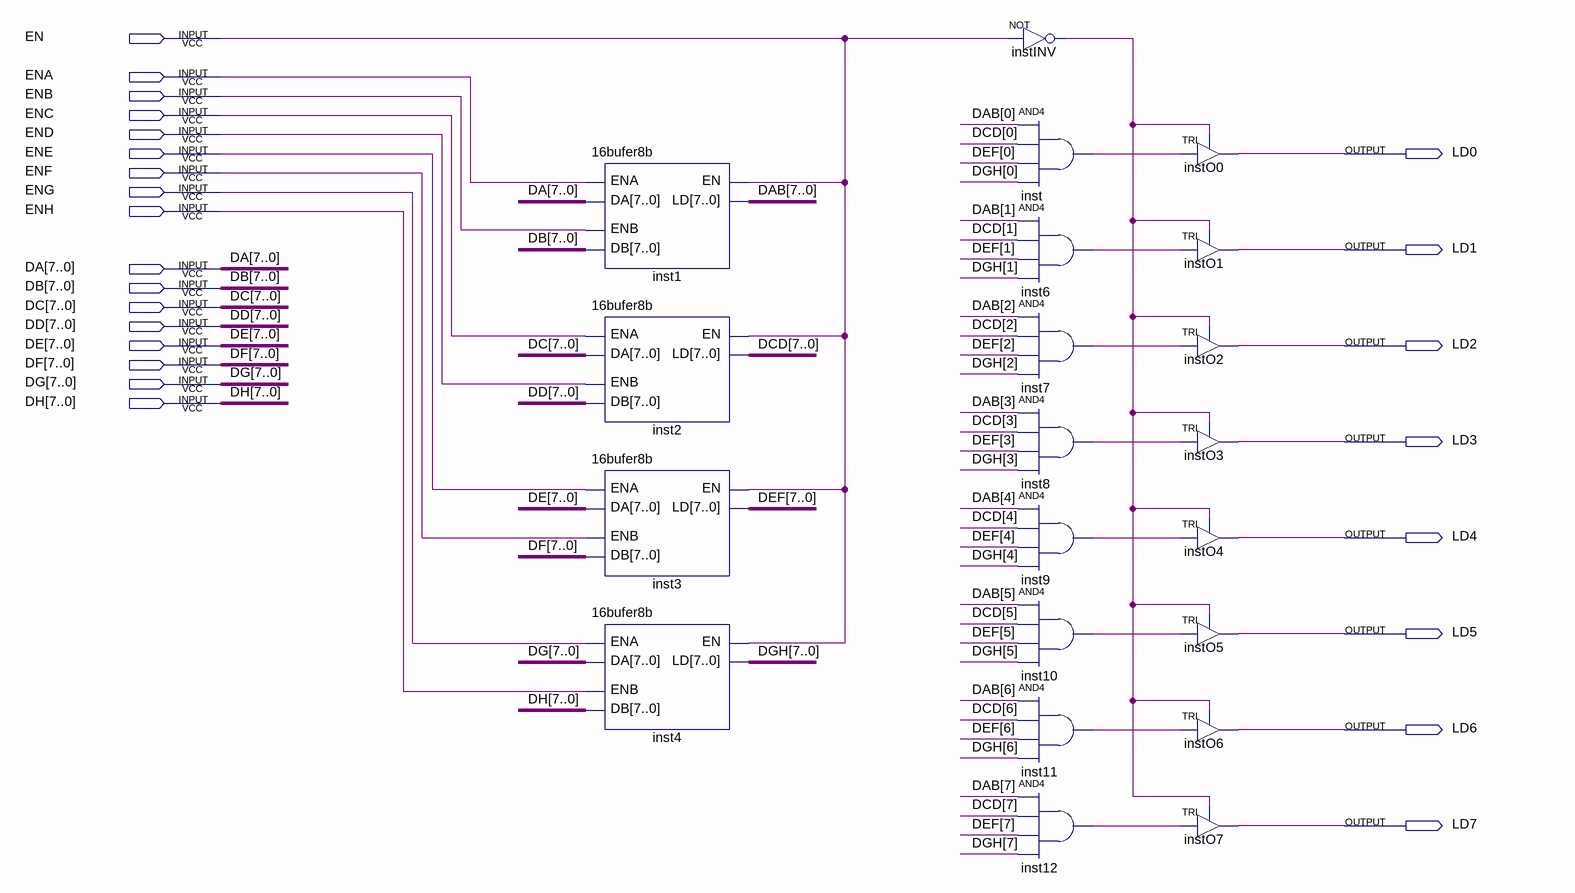
[diagram p0: schematic sheet]
// Quartus schematic 64bufer8b.bdf as structural Verilog: 21 symbols, 25 pins
module \64bufer8b  (
  input  EN,
  input  ENA,
  input  ENB,
  input  ENC,
  input  END,
  input  ENE,
  input  ENF,
  input  ENG,
  input  ENH,
  input  [7:0] DA,
  input  [7:0] DB,
  input  [7:0] DC,
  input  [7:0] DD,
  input  [7:0] DE,
  input  [7:0] DF,
  input  [7:0] DG,
  input  [7:0] DH,
  output LD0,
  output LD1,
  output LD2,
  output LD3,
  output LD4,
  output LD5,
  output LD6,
  output LD7
);

  wire inst6_out, inst7_out, inst8_out, inst9_out, inst10_out, inst11_out, inst12_out, inst_out, instINV_out;
  wire [7:0] DAB, DCD, DEF, DGH;

  \16bufer8b  inst1 (.EN(EN), .ENA(ENA), .ENB(ENB), .DA(DA), .DB(DB), .LD(DAB));
  \16bufer8b  inst2 (.EN(EN), .ENA(ENC), .ENB(END), .DA(DC), .DB(DD), .LD(DCD));
  \16bufer8b  inst3 (.EN(EN), .ENA(ENE), .ENB(ENF), .DA(DE), .DB(DF), .LD(DEF));
  \16bufer8b  inst4 (.EN(EN), .ENA(ENG), .ENB(ENH), .DA(DG), .DB(DH), .LD(DGH));
  not instINV (instINV_out, EN);
  and inst (inst_out, DAB[0], DCD[0], DEF[0], DGH[0]);
  and inst6 (inst6_out, DAB[1], DCD[1], DEF[1], DGH[1]);
  and inst7 (inst7_out, DAB[2], DCD[2], DEF[2], DGH[2]);
  and inst8 (inst8_out, DAB[3], DCD[3], DEF[3], DGH[3]);
  and inst9 (inst9_out, DAB[4], DCD[4], DEF[4], DGH[4]);
  and inst10 (inst10_out, DAB[5], DCD[5], DEF[5], DGH[5]);
  and inst11 (inst11_out, DAB[6], DCD[6], DEF[6], DGH[6]);
  and inst12 (inst12_out, DAB[7], DCD[7], DEF[7], DGH[7]);
  TRI instO0 (.IN(inst_out), .OE(instINV_out), .OUT(LD0));
  TRI instO1 (.IN(inst6_out), .OE(instINV_out), .OUT(LD1));
  TRI instO2 (.IN(inst7_out), .OE(instINV_out), .OUT(LD2));
  TRI instO3 (.IN(inst8_out), .OE(instINV_out), .OUT(LD3));
  TRI instO4 (.IN(inst9_out), .OE(instINV_out), .OUT(LD4));
  TRI instO5 (.IN(inst10_out), .OE(instINV_out), .OUT(LD5));
  TRI instO6 (.IN(inst11_out), .OE(instINV_out), .OUT(LD6));
  TRI instO7 (.IN(inst12_out), .OE(instINV_out), .OUT(LD7));
endmodule
